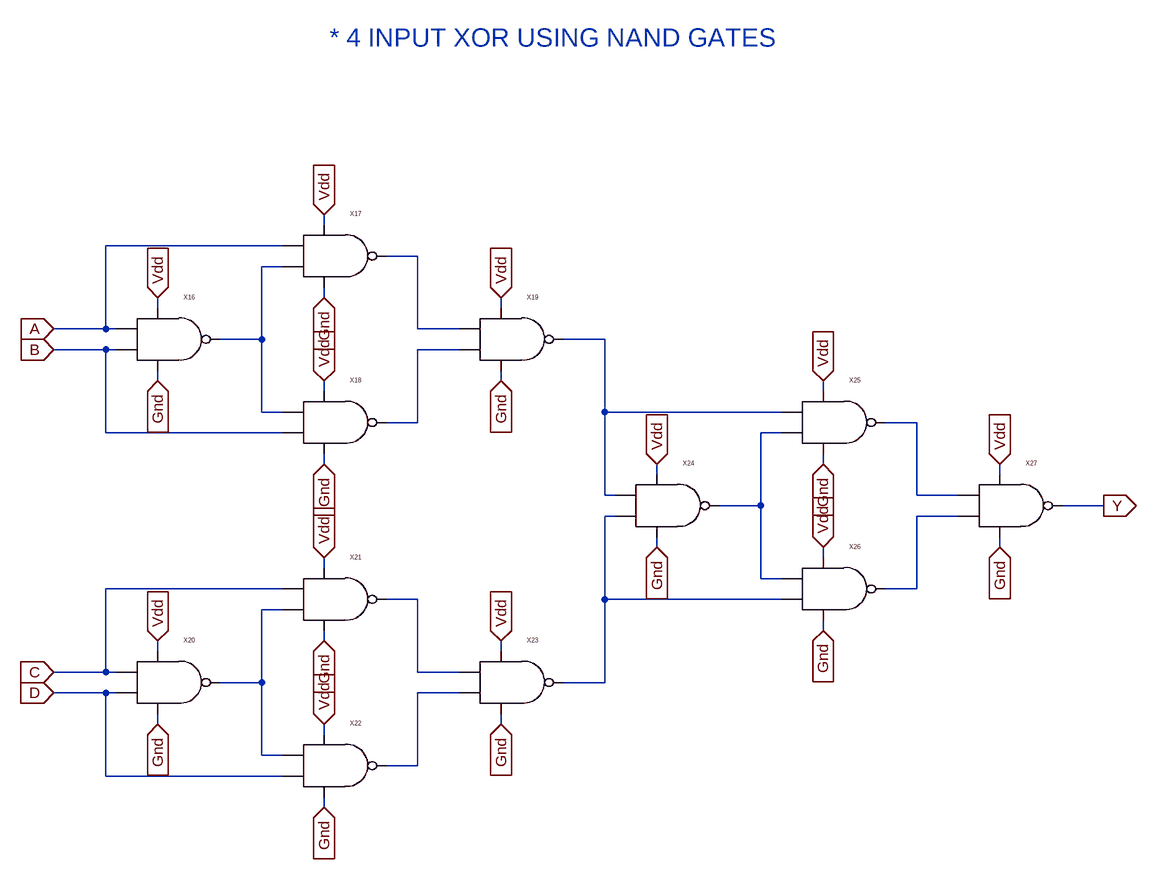
[diagram p0: schematic 4xor.asc]
4xor.asc, the LTspice schematic file:
Version 4
SHEET 1 2908 872
WIRE -16 -560 -16 -576
WIRE -80 -528 -352 -528
WIRE 128 -512 80 -512
WIRE -80 -496 -112 -496
WIRE -16 -448 -16 -464
WIRE -272 -432 -272 -448
WIRE 256 -432 256 -448
WIRE -352 -400 -352 -528
WIRE -352 -400 -432 -400
WIRE -336 -400 -352 -400
WIRE 128 -400 128 -512
WIRE 192 -400 128 -400
WIRE -112 -384 -112 -496
WIRE -112 -384 -176 -384
WIRE 416 -384 352 -384
WIRE -352 -368 -432 -368
WIRE -336 -368 -352 -368
WIRE 192 -368 128 -368
WIRE -272 -320 -272 -336
WIRE 256 -320 256 -336
WIRE -16 -304 -16 -320
WIRE 752 -304 752 -320
WIRE -112 -272 -112 -384
WIRE -80 -272 -112 -272
WIRE 416 -272 416 -384
WIRE 688 -272 416 -272
WIRE 128 -256 128 -368
WIRE 128 -256 80 -256
WIRE 896 -256 848 -256
WIRE -352 -240 -352 -368
WIRE -80 -240 -352 -240
WIRE 688 -240 656 -240
WIRE -16 -192 -16 -208
WIRE 752 -192 752 -208
WIRE 496 -176 496 -192
WIRE 1024 -176 1024 -192
WIRE 416 -144 416 -272
WIRE 432 -144 416 -144
WIRE 896 -144 896 -256
WIRE 960 -144 896 -144
WIRE 656 -128 656 -240
WIRE 656 -128 592 -128
WIRE 1184 -128 1120 -128
WIRE 432 -112 416 -112
WIRE 960 -112 896 -112
WIRE 496 -64 496 -80
WIRE 1024 -64 1024 -80
WIRE 752 -48 752 -64
WIRE -16 -32 -16 -48
WIRE 656 -16 656 -128
WIRE 688 -16 656 -16
WIRE -80 0 -352 0
WIRE 896 0 896 -112
WIRE 896 0 848 0
WIRE 128 16 80 16
WIRE 416 16 416 -112
WIRE 688 16 416 16
WIRE -80 32 -112 32
WIRE 752 64 752 48
WIRE -16 80 -16 64
WIRE -272 96 -272 80
WIRE 256 96 256 80
WIRE -352 128 -352 0
WIRE -352 128 -432 128
WIRE -336 128 -352 128
WIRE 128 128 128 16
WIRE 192 128 128 128
WIRE -112 144 -112 32
WIRE -112 144 -176 144
WIRE 416 144 416 16
WIRE 416 144 352 144
WIRE -352 160 -432 160
WIRE -336 160 -352 160
WIRE 192 160 128 160
WIRE -272 208 -272 192
WIRE 256 208 256 192
WIRE -16 224 -16 208
WIRE -112 256 -112 144
WIRE -80 256 -112 256
WIRE 128 272 128 160
WIRE 128 272 80 272
WIRE -352 288 -352 160
WIRE -80 288 -352 288
WIRE -16 336 -16 320
FLAG -16 -576 Vdd
IOPIN -16 -576 In
FLAG -272 -448 Vdd
IOPIN -272 -448 In
FLAG -16 -320 Vdd
IOPIN -16 -320 In
FLAG 256 -448 Vdd
IOPIN 256 -448 In
FLAG -432 160 D
IOPIN -432 160 In
FLAG -432 128 C
IOPIN -432 128 In
FLAG -432 -400 A
IOPIN -432 -400 In
FLAG -432 -368 B
IOPIN -432 -368 In
FLAG 256 -320 Gnd
IOPIN 256 -320 In
FLAG -16 -192 Gnd
IOPIN -16 -192 In
FLAG -16 -448 Gnd
IOPIN -16 -448 In
FLAG -272 -320 Gnd
IOPIN -272 -320 In
FLAG -16 -48 Vdd
IOPIN -16 -48 In
FLAG -272 80 Vdd
IOPIN -272 80 In
FLAG -16 208 Vdd
IOPIN -16 208 In
FLAG 256 80 Vdd
IOPIN 256 80 In
FLAG 256 208 Gnd
IOPIN 256 208 In
FLAG -16 336 Gnd
IOPIN -16 336 In
FLAG -16 80 Gnd
IOPIN -16 80 In
FLAG -272 208 Gnd
IOPIN -272 208 In
FLAG 752 -320 Vdd
IOPIN 752 -320 In
FLAG 496 -192 Vdd
IOPIN 496 -192 In
FLAG 752 -64 Vdd
IOPIN 752 -64 In
FLAG 1024 -192 Vdd
IOPIN 1024 -192 In
FLAG 1024 -64 Gnd
IOPIN 1024 -64 In
FLAG 752 64 Gnd
IOPIN 752 64 In
FLAG 752 -192 Gnd
IOPIN 752 -192 In
FLAG 496 -64 Gnd
IOPIN 496 -64 In
FLAG 1184 -128 Y
IOPIN 1184 -128 Out
SYMBOL nand -272 -384 R0
SYMATTR InstName X16
SYMBOL nand -16 -512 R0
SYMATTR InstName X17
SYMBOL nand -16 -256 R0
SYMATTR InstName X18
SYMBOL nand 256 -384 R0
SYMATTR InstName X19
SYMBOL nand -272 144 R0
SYMATTR InstName X20
SYMBOL nand -16 16 R0
SYMATTR InstName X21
SYMBOL nand -16 272 R0
SYMATTR InstName X22
SYMBOL nand 256 144 R0
SYMATTR InstName X23
SYMBOL nand 496 -128 R0
SYMATTR InstName X24
SYMBOL nand 752 -256 R0
SYMATTR InstName X25
SYMBOL nand 752 0 R0
SYMATTR InstName X26
SYMBOL nand 1024 -128 R0
SYMATTR InstName X27
TEXT -8 -848 Left 4 ;* 4 INPUT XOR USING NAND GATES

The netlist it stands for:
* 4xor.asc
XX16 A B Vdd Gnd N002 nand  ; pins A B vdd gnd Y
XX17 A N002 Vdd Gnd N001 nand  ; pins A B vdd gnd Y
XX18 N002 B Vdd Gnd N004 nand  ; pins A B vdd gnd Y
XX19 N001 N004 Vdd Gnd N003 nand  ; pins A B vdd gnd Y
XX20 C D Vdd Gnd N010 nand  ; pins A B vdd gnd Y
XX21 C N010 Vdd Gnd N009 nand  ; pins A B vdd gnd Y
XX22 N010 D Vdd Gnd N011 nand  ; pins A B vdd gnd Y
XX23 N009 N011 Vdd Gnd N007 nand  ; pins A B vdd gnd Y
XX24 N003 N007 Vdd Gnd N006 nand  ; pins A B vdd gnd Y
XX25 N003 N006 Vdd Gnd N005 nand  ; pins A B vdd gnd Y
XX26 N006 N007 Vdd Gnd N008 nand  ; pins A B vdd gnd Y
XX27 N005 N008 Vdd Gnd Y nand  ; pins A B vdd gnd Y
* * 4 INPUT XOR USING NAND GATES
.backanno
.end